# EAGLE schematic MICRO_LEDS (EAGLE 7.4.0)
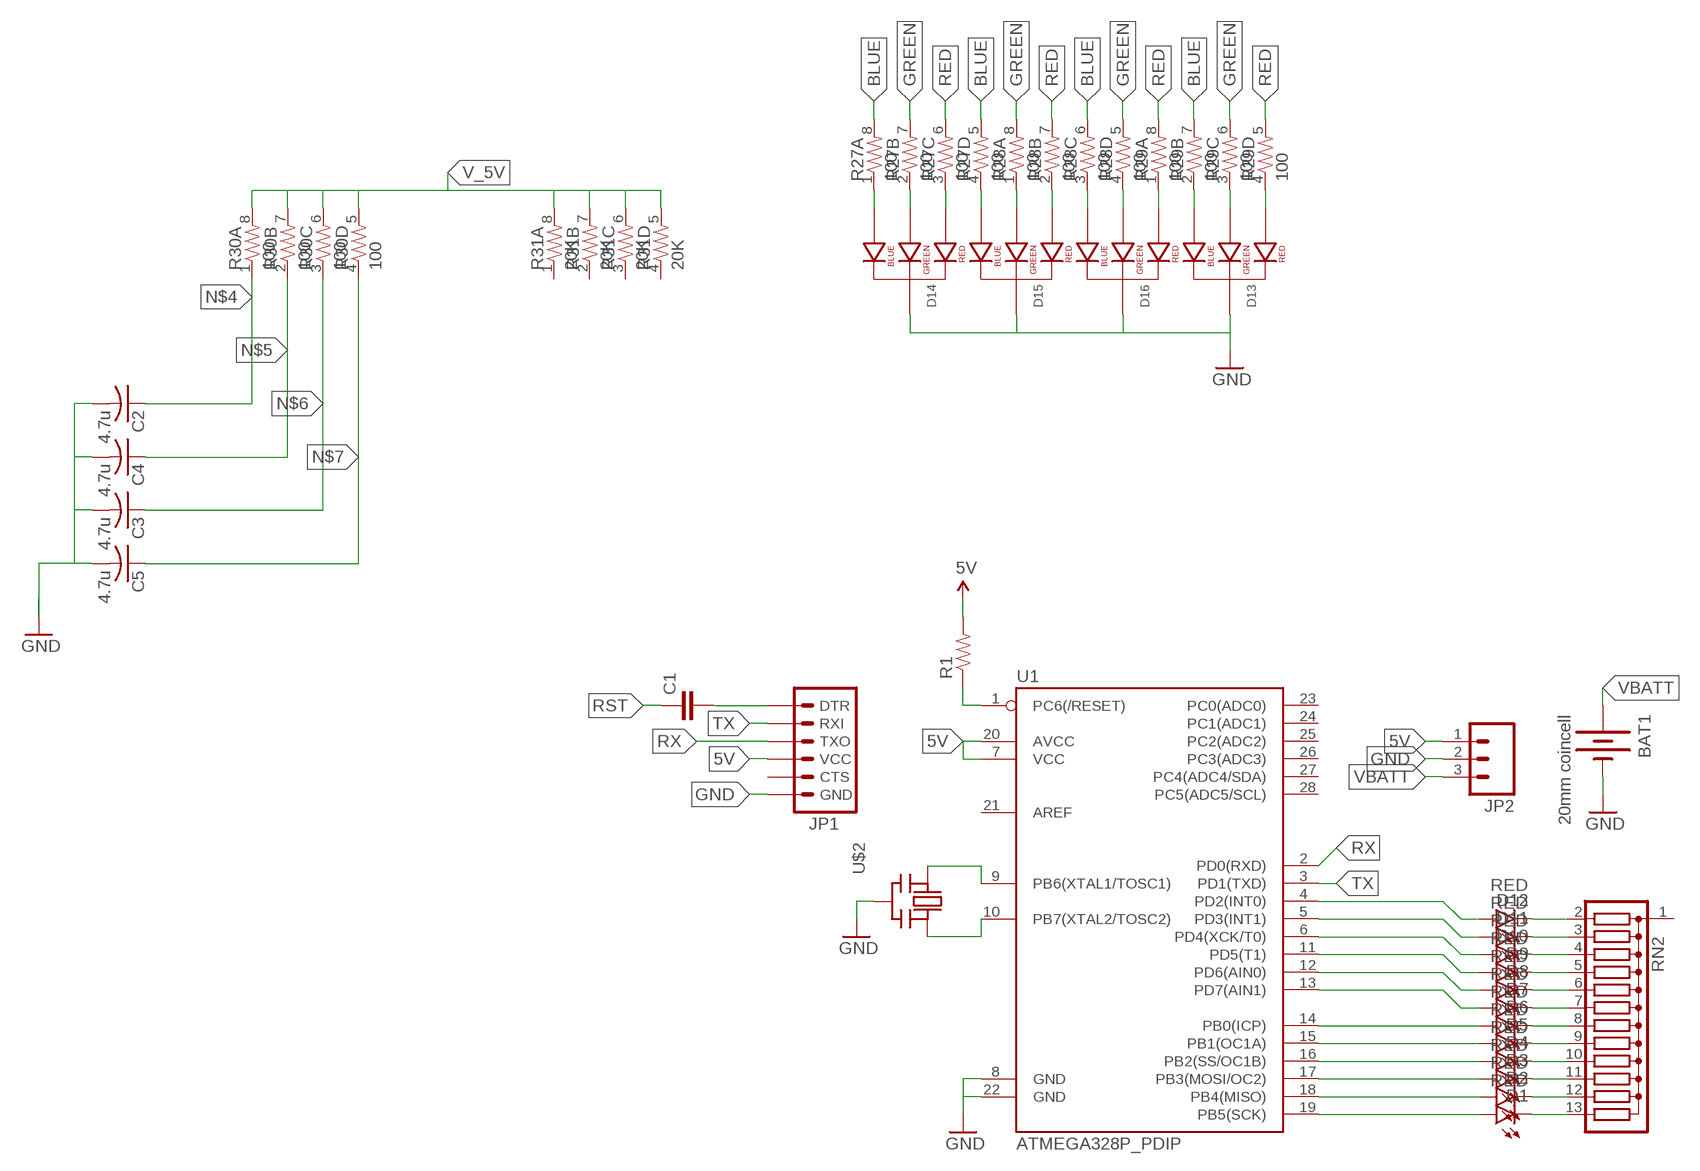
[diagram p0: schematic, sheet 1]

## Parts
BAT1  20mm coincell  BATTERY20PTH  [BATTCOM_20MM_PTH]
C1  CAPPTH1  [CAP-PTH-5MM]
C2  4.7u  C-USC0805  [C0805]
C3  4.7u  C-USC0805  [C0805]
C4  4.7u  C-USC0805  [C0805]
C5  4.7u  C-USC0805  [C0805]
D1  RED  LED3MM  [LED3MM]
D2  RED  LED3MM  [LED3MM]
D3  RED  LED3MM  [LED3MM]
D4  RED  LED3MM  [LED3MM]
D5  RED  LED3MM  [LED3MM]
D6  RED  LED3MM  [LED3MM]
D7  RED  LED3MM  [LED3MM]
D8  RED  LED3MM  [LED3MM]
D9  RED  LED3MM  [LED3MM]
D10  RED  LED3MM  [LED3MM]
D11  RED  LED3MM  [LED3MM]
D12  RED  LED3MM  [LED3MM]
D13  LED-RGB-CC-THRUDIFFUSE  [LED-RGB-THRU]
D14  LED-RGB-CC-THRUDIFFUSE  [LED-RGB-THRU]
D15  LED-RGB-CC-THRUDIFFUSE  [LED-RGB-THRU]
D16  LED-RGB-CC-THRUDIFFUSE  [LED-RGB-THRU]
JP1  ARDUINO_SERIAL_PROGRAMLONGPADS  [1X06_LONGPADS]
JP2  M03-SCREW-5MM  [SCREWTERMINAL-5MM-3]
R1  RESISTORPTH-1/4W  [AXIAL-0.4]
R27  100  RESISTOR-ARRAY0603-ARV  [0603-ARV]
R28  100  RESISTOR-ARRAY0603-ARV  [0603-ARV]
R29  100  RESISTOR-ARRAY0603-ARV  [0603-ARV]
R30  100  RESISTOR-ARRAY0603-ARV  [0603-ARV]
R31  20K  RESISTOR-ARRAY0603-ARV  [0603-ARV]
RN2  G12R  [SIL13]
U1  ATMEGA328P_PDIP  [DIL28-3]
U$2  CERMOSCILL-THM  [CERM_OSC]

## Nets
5V: JP1.4(VCC) JP2.1 R1.P$2 U1.7(VCC) U1.20(AVCC)
GND: BAT1.2(-) C2.2 C3.2 C4.2 C5.2 D13.2(CATHODE) D14.2(CATHODE) D15.2(CATHODE) D16.2(CATHODE) JP1.6(GND) JP2.2 U1.8(GND) U1.22(GND) U$2.P$2(GND)
N$1: U1.9(PB6(XTAL1/TOSC1)) U$2.P$1(IN)
N$2: U1.10(PB7(XTAL2/TOSC2)) U$2.P$3(OUT)
N$3: D1.A U1.19(PB5(SCK))
N$4: C2.1 D1.K(C) R30.1 RN2.13
N$5: C4.1 D2.A R30.2 U1.18(PB4(MISO))
N$6: C3.1 D2.K(C) R30.3 RN2.12
N$7: C5.1 D3.A R30.4 U1.17(PB3(MOSI/OC2))
N$8: D3.K(C) RN2.11
N$9: D4.A U1.16(PB2(SS/OC1B))
N$10: D4.K(C) RN2.10
N$11: D5.A U1.15(PB1(OC1A))
N$12: D5.K(C) RN2.9
N$13: D6.A U1.14(PB0(ICP))
N$14: D6.K(C) RN2.8
N$15: D7.A U1.13(PD7(AIN1))
N$16: D8.A U1.12(PD6(AIN0))
N$17: D9.A U1.11(PD5(T1))
N$18: D10.A U1.6(PD4(XCK/T0))
N$19: D11.A U1.5(PD3(INT1))
N$20: D12.A U1.4(PD2(INT0))
N$21: D7.K(C) RN2.7
N$22: D8.K(C) RN2.6
N$23: D9.K(C) RN2.5
N$24: D10.K(C) RN2.4
N$25: D11.K(C) RN2.3
N$26: D12.K(C) RN2.2
N$27: R1.P$1 U1.1(PC6(/RESET))
N$28: D14.4(BLUE_CATHODE) R27.1
N$29: C1.2 JP1.1(DTR)
N$30: D14.3(GREEN_CATHODE) R27.2
N$31: D14.1(RED_CATHODE) R27.3
N$32: D15.4(BLUE_CATHODE) R27.4
N$33: D15.3(GREEN_CATHODE) R28.1
N$34: D15.1(RED_CATHODE) R28.2
N$35: D16.4(BLUE_CATHODE) R28.3
N$36: D16.3(GREEN_CATHODE) R28.4
N$37: D16.1(RED_CATHODE) R29.1
N$38: D13.4(BLUE_CATHODE) R29.2
N$39: D13.3(GREEN_CATHODE) R29.3
N$40: D13.1(RED_CATHODE) R29.4
N$41: R27.8
N$42: R27.7
N$43: R27.6
N$44: R27.5
N$45: R28.8
N$46: R28.7
N$47: R28.6
N$48: R28.5
N$49: R29.8
N$50: R29.7
N$51: R29.6
N$52: R29.5
RST: C1.1
RX: JP1.3(TXO) U1.2(PD0(RXD))
TX: JP1.2(RXI) U1.3(PD1(TXD))
V_5V: R30.5 R30.6 R30.7 R30.8 R31.5 R31.6 R31.7 R31.8
VBATT: BAT1.1(+) JP2.3
Unconnected: JP1.5(CTS) R31.1 R31.2 R31.3 R31.4 RN2.1 U1.21(AREF) U1.23(PC0(ADC0)) U1.24(PC1(ADC1)) U1.25(PC2(ADC2)) U1.26(PC3(ADC3)) U1.27(PC4(ADC4/SDA)) U1.28(PC5(ADC5/SCL))

## Library data of the parts
BAT1 = SparkFun-Electromechanical:BATTERY: Battery Holders Various common sizes : AA, AAA, 18650 (PRT-12895), 20mm coin cell and 12mm coin cell. 20MM_4LEGS, BATT-10373
C1 = SparkFun-Capacitors:CAP: Capacitor Standard 0603 ceramic capacitor, and 0.1" leaded capacitor.
C2-C5 = adafruit:C-US: CAPACITOR, American symbol
D1-D12 = SparkFun-LED:LED: LEDs Standard schematic elements and footprints for 5mm, 3mm, 1206, and 0603 sized LEDs. 5mm - Spark Fun Electronics SKU : COM-00529 (and others)
D13-D16 = SparkFun-LED:LED-RGB-CC-THRU: RGB Through-hole common cathode LED SparkFun Storefront: COM-00105 (Clear) COM-09264 (Diffuse); PROD_ID: DIO-09434
JP1 = SparkFun-Connectors:ARDUINO_SERIAL_PROGRAM: FTDI connector footprints
JP2 = SparkFun-Connectors:M03: Header 3 Standard 3-pin 0.1" header. Use with straight break away headers (SKU : PRT-00116), right angle break away headers (PRT-00553), swiss pins (PRT-00743), machine pins (PRT-00117), and female headers (PRT-00115). Molex polarized connector foot print use with SKU : PRT-08232 with associated crimp pins and housings.; STOREFRONT_ID: PRT-08433
R1 = SparkFun-Resistors:RESISTOR: Resistor Basic schematic elements and footprints for 0603, 1206, and PTH resistors.
R27-R31 = SparkFun-Passives:RESISTOR-ARRAY: Array Chip Resistor Source: RS Component / Phycomp
RN2 = resistor-sil:G12R: SIL RESISTOR; OC_FARNELL: unknown; OC_NEWARK: unknown
U1 = SparkFun-DigitalIC:ATMEGA328P_PDIP: uC used in the Arduino 32kb flash, 1k EEPROM, 2k SRAM This is the through-hole version of this chip.
U$2 = adafruit:CERMOSCILL: Ceramic oscillator with built in capacitors such as ZTT-12MHz http://www.ladyada.net/library/eagle

## Net classes
0 default: width 1.016 mm, drill 0.508 mm, clearance 0.508 mm